# Altium schematic sheet SuperFin Baseboard pg8.SchDoc
size B
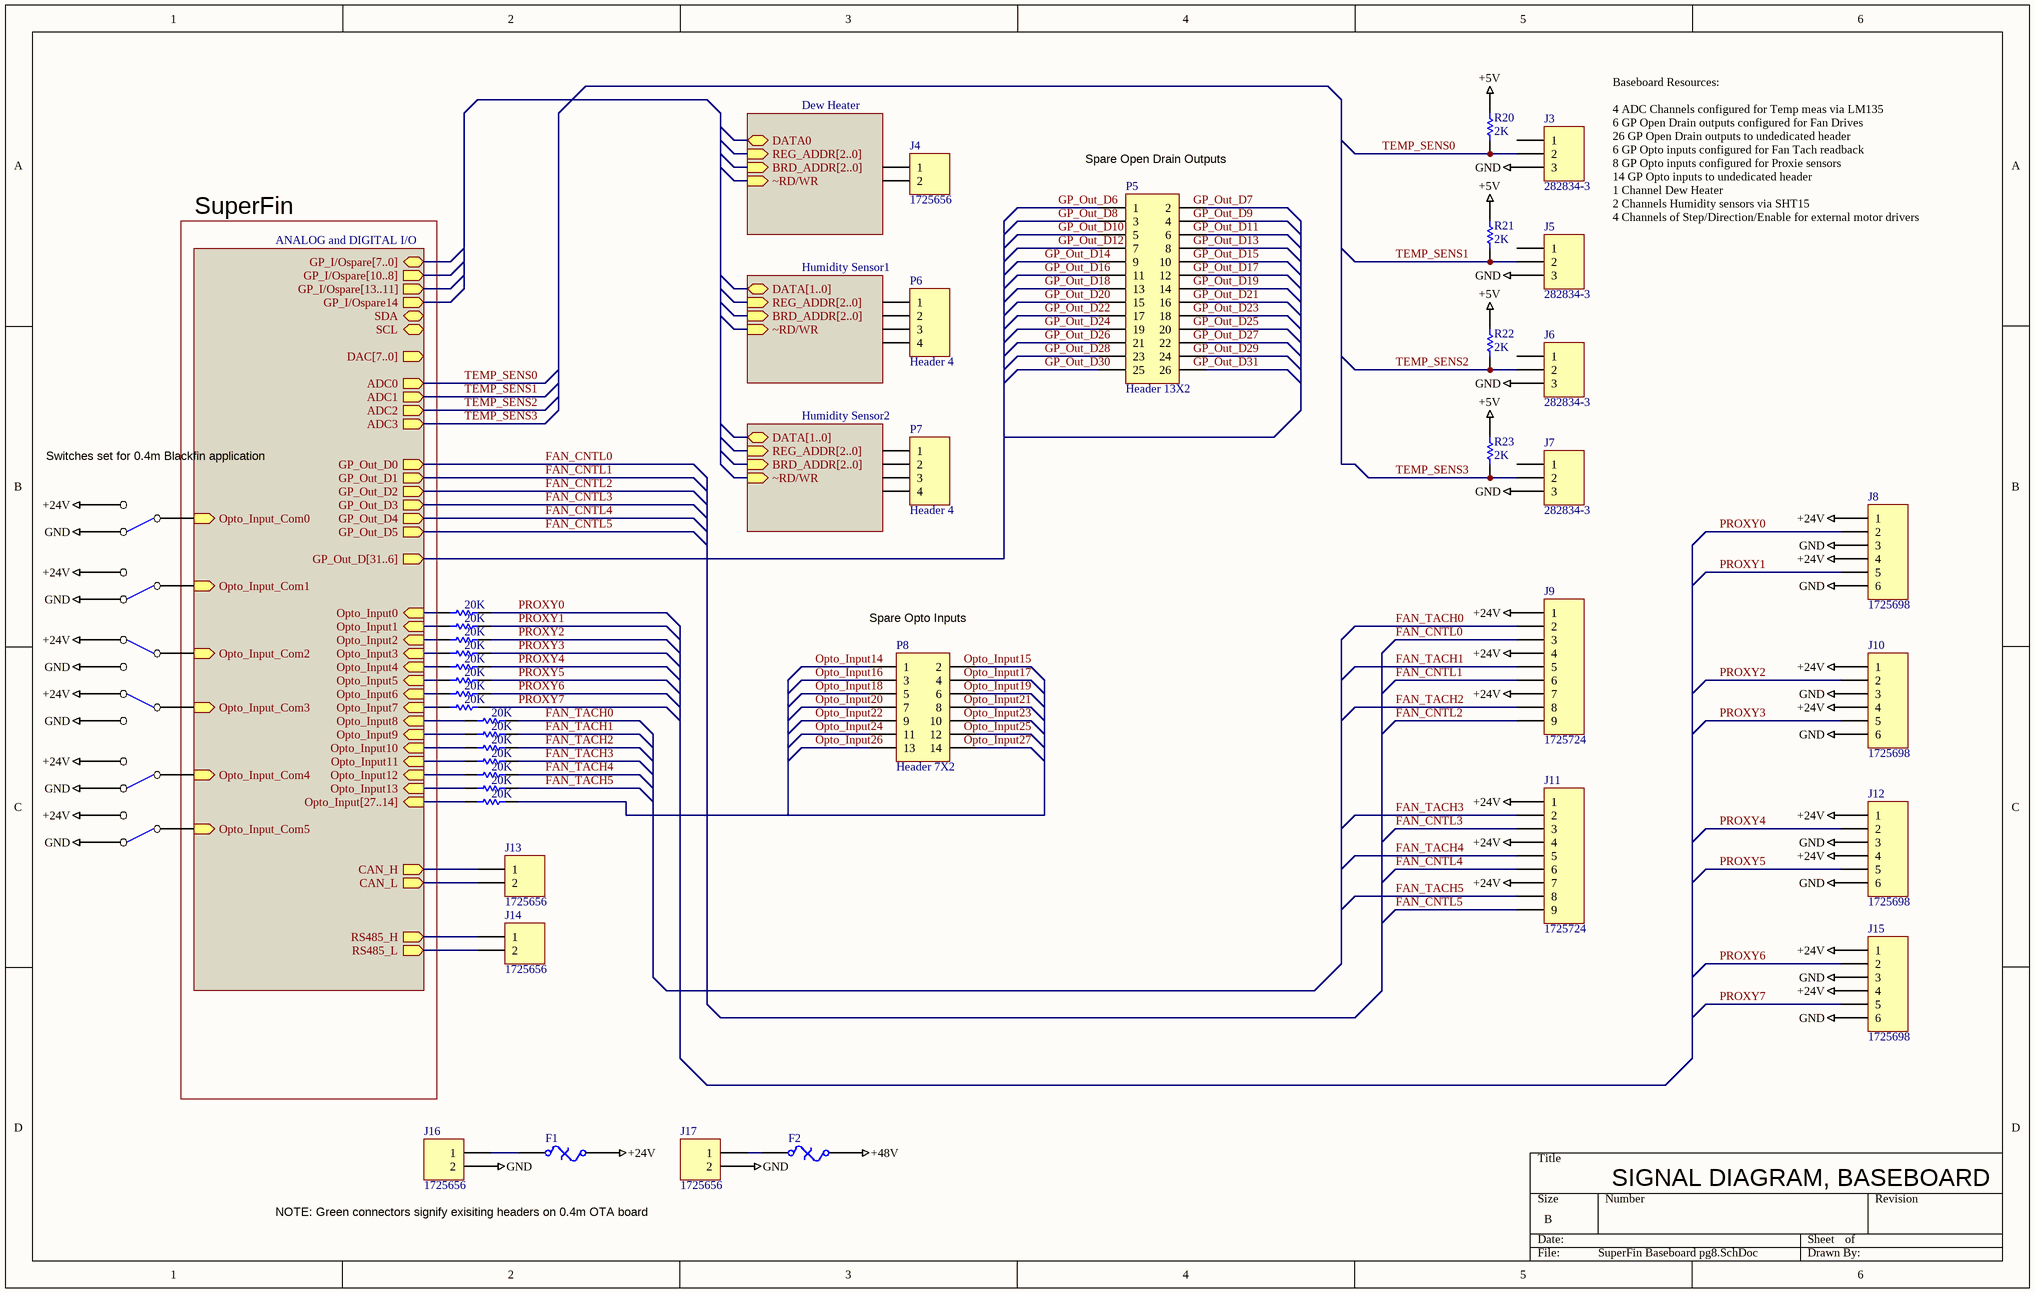
[diagram p0: SuperFin Baseboard pg8.SchDoc]

## Parts
*2  SW_SPDT_DOUG  (value not drawn)
*3  SW_SPDT_DOUG  (value not drawn)
*4  SW_SPDT_DOUG  (value not drawn)
*5  SW_SPDT_DOUG  (value not drawn)
*6  SW_SPDT_DOUG  (value not drawn)
*7  SW_SPDT_DOUG  (value not drawn)
F1  Fuse Thermal  [PolySwitch Radial 0.2]  (value not drawn)
F2  Fuse Thermal  [PolySwitch Radial 0.2]  (value not drawn)
J3  282834-3  [Tyco Electronics 282834-3]
J4  1725656  [Phoenix_1725656]
J5  282834-3  [Tyco Electronics 282834-3]
J6  282834-3  [Tyco Electronics 282834-3]
J7  282834-3  [Tyco Electronics 282834-3]
J8  1725698  [1725698]
J9  1725724  [1725724]
J10  1725698  [1725698]
J11  1725724  [1725724]
J12  1725698  [1725698]
J13  1725656  [Phoenix_1725656]
J14  1725656  [Phoenix_1725656]
J15  1725698  [1725698]
J16  1725656  [Phoenix_1725656]
J17  1725656  [Phoenix_1725656]
P5  Header 13X2  [HDR2X13]
P6  Header 4  [HDR1X4]
P7  Header 4  [HDR1X4]
P8  Header 7X2  [HDR2X7]
R20  value 2K  [AXIAL-0.4]  (hidden comment: Res TH)
R21  value 2K  [AXIAL-0.4]  (hidden comment: Res TH)
R22  value 2K  [AXIAL-0.4]  (hidden comment: Res TH)
R23  value 2K  [AXIAL-0.4]  (hidden comment: Res TH)
R24  value 20K  [SMD_0805]  (hidden comment: Res 0805)
R25  value 20K  [SMD_0805]  (hidden comment: Res 0805)
R26  value 20K  [SMD_0805]  (hidden comment: Res 0805)
R27  value 20K  [SMD_0805]  (hidden comment: Res 0805)
R28  value 20K  [SMD_0805]  (hidden comment: Res 0805)
R29  value 20K  [SMD_0805]  (hidden comment: Res 0805)
R30  value 20K  [SMD_0805]  (hidden comment: Res 0805)
R31  value 20K  [SMD_0805]  (hidden comment: Res 0805)
R32  value 20K  [SMD_0805]  (hidden comment: Res 0805)
R33  value 20K  [SMD_0805]  (hidden comment: Res 0805)
R34  value 20K  [SMD_0805]  (hidden comment: Res 0805)
R35  value 20K  [SMD_0805]  (hidden comment: Res 0805)
R36  value 20K  [SMD_0805]  (hidden comment: Res 0805)
R37  value 20K  [SMD_0805]  (hidden comment: Res 0805)
R38  value 20K  [SMD_0805]  (hidden comment: Res 0805)

## Sub-sheets
? = ANALOG and DIGITAL I/O: DAC[7..0] (out), SDA (bidir), SCL (bidir), Opto_Input8 (in), Opto_Input9 (in), Opto_Input10 (in), Opto_Input11 (in), Opto_Input12 (in), Opto_Input13 (in), GP_Out_D0 (out), GP_Out_D1 (out), GP_Out_D2 (out), GP_Out_D3 (out), GP_Out_D4 (out), GP_Out_D5 (out), ADC0 (out), ADC1 (out), ADC2 (out), ADC3 (out), Opto_Input0 (in), Opto_Input1 (in), Opto_Input2 (in), Opto_Input3 (in), Opto_Input4 (in), Opto_Input5 (in), Opto_Input6 (in), Opto_Input7 (in), Opto_Input_Com0 (in), Opto_Input_Com1 (in), Opto_Input_Com2 (in), Opto_Input_Com3 (in), Opto_Input_Com4 (in), Opto_Input_Com5 (in), Opto_Input[27..14] (in), GP_Out_D[31..6] (out), GP_I/Ospare[7..0] (bidir), GP_I/Ospare[10..8] (out), GP_I/Ospare[13..11] (out), GP_I/Ospare14 (out), CAN_H (out), CAN_L (out), RS485_H (out), RS485_L (out)
? = Dew Heater: DATA0 (bidir), REG_ADDR[2..0] (in), BRD_ADDR[2..0] (in), ~RD/WR (in)
? = Humidity Sensor1: DATA[1..0] (bidir), REG_ADDR[2..0] (in), BRD_ADDR[2..0] (in), ~RD/WR (in)
? = Humidity Sensor2: DATA[1..0] (bidir), REG_ADDR[2..0] (in), BRD_ADDR[2..0] (in), ~RD/WR (in)

## Nets
+5V: R20.2 R21.2 R22.2 R23.2
+24V: *2.NO *3.NO *4.NC *5.NC *6.NO *7.NO F1.2 J8.1 J8.4 J9.1 J9.4 J9.7 J10.1 J10.4 J11.1 J11.4 J11.7 J12.1 J12.4 J15.1 J15.4
+48V: F2.2
GND: *2.NC *3.NC *4.NO *5.NO *6.NC *7.NC J3.3 J5.3 J6.3 J7.3 J8.3 J8.6 J10.3 J10.6 J12.3 J12.6 J15.3 J15.6 J16.2 J17.2
FAN_CNTL0: J9.3 ; sheet /GP_Out_D0
FAN_CNTL1: J9.6 ; sheet /GP_Out_D1
FAN_CNTL2: J9.9 ; sheet /GP_Out_D2
FAN_CNTL3: J11.3 ; sheet /GP_Out_D3
FAN_CNTL4: J11.6 ; sheet /GP_Out_D4
FAN_CNTL5: J11.9 ; sheet /GP_Out_D5
FAN_TACH0: J9.2 R32.2
FAN_TACH1: J9.5 R33.2
FAN_TACH2: J9.8 R34.2
FAN_TACH3: J11.2 R35.2
FAN_TACH4: J11.5 R36.2
FAN_TACH5: J11.8 R37.2
GP_Out_D6: P5.1
GP_Out_D8: P5.3
GP_Out_D10: P5.5
GP_Out_D12: P5.7
GP_Out_D14: P5.9
GP_Out_D16: P5.11
GP_Out_D18: P5.13
GP_Out_D20: P5.15
GP_Out_D22: P5.17
GP_Out_D24: P5.19
GP_Out_D26: P5.21
GP_Out_D28: P5.23
GP_Out_D30: P5.25
Opto_Input14: P8.1
Opto_Input16: P8.3
Opto_Input18: P8.5
Opto_Input20: P8.7
Opto_Input22: P8.9
Opto_Input24: P8.11
Opto_Input26: P8.13
PROXY0: J8.2 R24.2
PROXY1: J8.5 R25.2
PROXY2: J10.2 R26.2
PROXY3: J10.5 R27.2
PROXY4: J12.2 R28.2
PROXY5: J12.5 R29.2
PROXY6: J15.2 R30.2
PROXY7: J15.5 R31.2
TEMP_SENS0: J3.2 R20.1 ; sheet /ADC0
TEMP_SENS1: J5.2 R21.1 ; sheet /ADC1
TEMP_SENS2: J6.2 R22.1 ; sheet /ADC2
TEMP_SENS3: J7.2 R23.1 ; sheet /ADC3
Net*2_COM: *2.COM ; sheet /Opto_Input_Com0
Net*3_COM: *3.COM ; sheet /Opto_Input_Com1
Net*4_COM: *4.COM ; sheet /Opto_Input_Com2
Net*5_COM: *5.COM ; sheet /Opto_Input_Com3
Net*6_COM: *6.COM ; sheet /Opto_Input_Com4
Net*7_COM: *7.COM ; sheet /Opto_Input_Com5
NetF1_1: F1.1 J16.1
NetF2_1: F2.1 J17.1
NetJ13_1: J13.1 ; sheet /CAN_H
NetJ13_2: J13.2 ; sheet /CAN_L
NetJ14_1: J14.1 ; sheet /RS485_H
NetJ14_2: J14.2 ; sheet /RS485_L
NetR24_1: R24.1 ; sheet /Opto_Input0
NetR25_1: R25.1 ; sheet /Opto_Input1
NetR26_1: R26.1 ; sheet /Opto_Input2
NetR27_1: R27.1 ; sheet /Opto_Input3
NetR28_1: R28.1 ; sheet /Opto_Input4
NetR29_1: R29.1 ; sheet /Opto_Input5
NetR30_1: R30.1 ; sheet /Opto_Input6
NetR31_1: R31.1 ; sheet /Opto_Input7
NetR32_1: R32.1 ; sheet /Opto_Input8
NetR33_1: R33.1 ; sheet /Opto_Input9
NetR34_1: R34.1 ; sheet /Opto_Input10
NetR35_1: R35.1 ; sheet /Opto_Input11
NetR36_1: R36.1 ; sheet /Opto_Input12
NetR37_1: R37.1 ; sheet /Opto_Input13

Not connected (* = marked no-connect by the designer): J3 1; J4 1 2; J5 1; J6 1; J7 1; P5 2 4 6 8 10 12 14 16 18 20 22 24 26; P6 1 2 3 4; P7 1 2 3 4; P8 2 4 6 8 10 12 14; R38 1 2

## Notes on the sheet
- (near P5) Spare Open Drain Outputs
- SuperFin
- Baseboard Resources:
  4 ADC Channels configured for Temp meas via LM135
  6 GP Open Drain outputs configured for Fan Drives
  26 GP Open Drain outputs to undedicated header
  6 GP Opto inputs configured for Fan Tach readback
  8 GP Opto inputs configured for Proxie sensors
  14 GP Opto inputs to undedicated header
  1 Channel Dew Heater
  2 Channels Humidity sensors via SHT15
  4 Channels of Step/Direction/Enable for external motor drivers
- (near *2) Switches set for 0.4m Blackfin application
- (near P8) Spare Opto Inputs
- NOTE: Green connectors signify exisiting headers on 0.4m OTA board
- SIGNAL DIAGRAM, BASEBOARD
- Labels drawn without touching a wire or pin: GP_Out_D7, GP_Out_D9, GP_Out_D11, GP_Out_D13, GP_Out_D15, GP_Out_D17, GP_Out_D19, GP_Out_D21, GP_Out_D23, GP_Out_D25, GP_Out_D27, GP_Out_D29, GP_Out_D31, Opto_Input15, Opto_Input17, Opto_Input19, Opto_Input21, Opto_Input23, Opto_Input25, Opto_Input27

## Library data of the parts
*2-*7 = SW_SPDT_DOUG: Right: 20; Bottom: 40
F1 F2 = Fuse Thermal: PolySwitch RUE Series
J3 J5-J7 = Header 3: Header, 3-Pin; Manufacturer: Tyco Electronics; Vendor: DIGIKEY; Vendor Mult.: 1; Vendor p/n: A98334-ND; Value: HEADER-3; LCO p/n: 125-00020; COST: 0.93; Manuf p/n: 282834-3
J4 J13 J14 J16 J17 = Header 2: Header, 2-Pin; Manufacturer: Phoenix Contact; Vendor: DIGIKEY; Vendor Mult.: 1; Vendor p/n: 277-1273-ND; Value: 2 PIN HEADER; LCO p/n: 125-00016; COST: 1.2; Manuf p/n: 1725656
J8 J10 J12 J15 = Header 6: Header, 6-Pin; Manufacturer: Phoenix Contact; Vendor: DIGIKEY; Vendor Mult.: 1; Vendor p/n: 277-1277-ND; Value: HEADER 6 POS; LCO p/n: 125-00017; COST: 3.61; Manuf p/n: 1725698
J9 J11 = Header 9: Header, 9-Pin; Manufacturer: Phoenix Contact; Vendor: DIGIKEY; Vendor Mult.: 1; Vendor p/n: 277-1280-ND; LCO p/n: 125-00018; COST: 5.43; Manuf p/n: 1725724; Value: 1725724
P5 = Header 13X2: Header, 13-Pin, Dual row; LatestRevisionDate: 17-Jul-2002; LatestRevisionNote: Re-released for DXP Platform.; Publisher: Altium Limited
P6 P7 = Header 4: Header, 4-Pin; LatestRevisionDate: 17-Jul-2002; LatestRevisionNote: Re-released for DXP Platform.; Publisher: Altium Limited
P8 = Header 7X2: Header, 7-Pin, Dual row; LatestRevisionDate: 17-Jul-2002; LatestRevisionNote: Re-released for DXP Platform.; Publisher: Altium Limited
R20-R23 = Res TH: Resistor
R24-R38 = Res SMD: Resistor 0805; Manufacturer: Vishay/Dale; Manuf p/n: CRCW080520KFKEA; Vendor: DIGIKEY; Vendor p/n: 541-20KCCT-ND; Vendor Mult.: 10; COST: 0.09